# Altium project St_Olavs_Alarm.PrjPcb
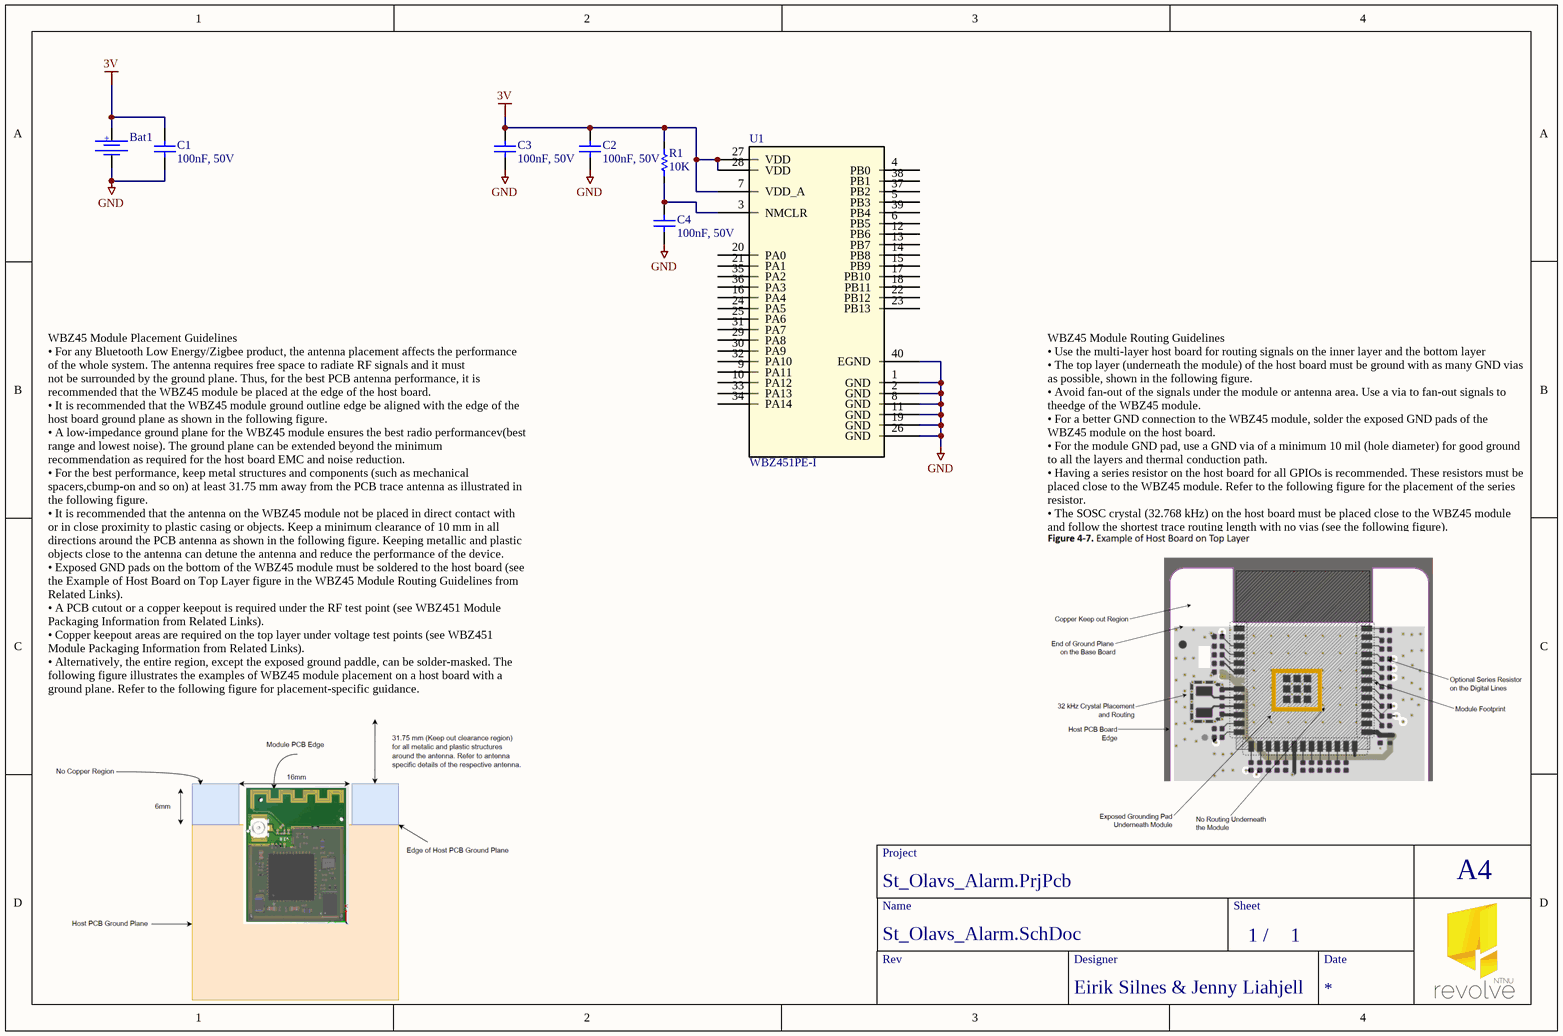
[diagram p0: St_Olavs_Alarm.SchDoc]
ProjectEngineer: Eirik Silnes & Jenny Liahjell
1 sheet, 7 parts. Net scope: strictly hierarchical (ports join the sheet entries above them; power ports are local).
Board file: St_Olavs_Alarm.PcbDoc

## Sheet St_Olavs_Alarm.SchDoc
size 292 x 193 mm; SheetNumber: 1; SheetTotal: 1

### Parts
Bat1  Bat Holder L-KLS5-CR2032-23-B1  [L-KLS5-CR2032-23-B1]  (value not drawn)
C1  100nF, 50V  [0603 Capacitor]
C2  100nF, 50V  [0603 Capacitor]
C3  100nF, 50V  [0603 Capacitor]
C4  100nF, 50V  [0603 Capacitor]
R1  10K  [0603 Resistor]
U1  WBZ451PE-I  [WBZ451_MCH]

### Nets
3V: Bat1.1 C1.2 C2.2 C3.2 R1.1 U1.7(VDD_A) U1.27(VDD) U1.28(VDD)
GND: Bat1.2 C1.1 C2.1 C3.1 C4.1 U1.1(GND) U1.2(GND) U1.8(GND) U1.11(GND) U1.19(GND) U1.26(GND) U1.40(EGND)
NetC4_2: C4.2 R1.2 U1.3(NMCLR)

Not connected (* = marked no-connect by the designer): U1 4(PB0) 5(PB3) 6(PB5) 9(PA11) 10(PA12) 12(PB6) 13(PB7) 14(PB8) 15(PB9) 16(PA4) 17(PB10) 18(PB11) 20(PA0) 21(PA1) 22(PB12) 23(PB13) 24(PA5) 25(PA6) 29(PA8) 30(PA9) 31(PA7) 32(PA10) 33(PA13) 34(PA14) 35(PA2) 36(PA3) 37(PB2) 38(PB1) 39(PB4)

### Notes on the sheet
- WBZ45 Module Routing Guidelines
  • Use the multi-layer host board for routing signals on the inner layer and the bottom layer
  • The top layer (underneath the module) of the host board must be ground with as many GND vias as possible, shown in the following figure.
  • Avoid fan-out of the signals under the module or antenna area. Use a via to fan-out signals to theedge of the WBZ45 module.
  • For a better GND connection to the WBZ45 module, solder the exposed GND pads of the WBZ45 module on the host board.
  • For the module GND pad, use a GND via of a minimum 10 mil (hole diameter) for good ground to all the layers and thermal conduction path.
  • Having a series resistor on the host board for all GPIOs is recommended. These resistors must be placed close to the WBZ45 module. Refer to the following figure for the placement of the series resistor.
  • The SOSC crystal (32.768 kHz) on the host board must be placed close to the WBZ45 module and follow the shortest trace routing length with no vias (see the following figure).
- WBZ45 Module Placement Guidelines
  • For any Bluetooth Low Energy/Zigbee product, the antenna placement affects the performance of the whole system. The antenna requires free space to radiate RF signals and it must
  not be surrounded by the ground plane. Thus, for the best PCB antenna performance, it is recommended that the WBZ45 module be placed at the edge of the host board.
  • It is recommended that the WBZ45 module ground outline edge be aligned with the edge of the
  host board ground plane as shown in the following figure.
  • A low-impedance ground plane for the WBZ45 module ensures the best radio performancev(best range and lowest noise). The ground plane can be extended beyond the minimum
  recommendation as required for the host board EMC and noise reduction.
  • For the best performance, keep metal structures and components (such as mechanical spacers,cbump-on and so on) at least 31.75 mm away from the PCB trace antenna as illustrated in the following figure.
  • It is recommended that the antenna on the WBZ45 module not be placed in direct contact with or in close proximity to plastic casing or objects. Keep a minimum clearance of 10 mm in all directions around the PCB antenna as shown in the following figure. Keeping metallic and plastic objects close to the antenna can detune the antenna and reduce the performance of the device.
  • Exposed GND pads on the bottom of the WBZ45 module must be soldered to the host board (see the Example of Host Board on Top Layer figure in the WBZ45 Module Routing Guidelines from Related Links).
  • A PCB cutout or a copper keepout is required under the RF test point (see WBZ451 Module Packaging Information from Related Links).
  • Copper keepout areas are required on the top layer under voltage test points (see WBZ451 Module Packaging Information from Related Links).
  • Alternatively, the entire region, except the exposed ground paddle, can be solder-masked. The following figure illustrates the examples of WBZ45 module placement on a host board with a ground plane. Refer to the following figure for placement-specific guidance.
- Project
- Name
- Sheet
- A4
- Rev
- Designer
- /
- Date
- (in symbol CMP-023-000003.0.1) +

### Library data of the parts
Bat1 = CMP-023-000003.0.1: Bat Holder CR2032 SMD; Manufacturer: KLS Electronic; Artikkelnr Noca: N.A.; Pad Count: 2; ComponentLink2URL: N.A.; Component Class: Connectors; ComponentLink1Description: Datasheet; LatestRevisionDate: 2019-08-29; Source: pca10056.SCHLIB; Author: rsk; Part Number: Bat Holder L-KLS5-CR2032-23-B1; Component Type: Standard; Value: Bat Holder CR2032; Footprint Doc: CR2032_HOLDER; Published: 2019-08-28; PartId: 100500651; Design Item ID: Bat Holder L-KLS5-CR2032-23-B1; ComponentLink2Description: Supplier link; Note: Bat Holder CR2032; Part number IPS: N.A.; ComponentLink1URL: http://www.klsele.com/admin/product_upload/20151124103736KLS5-CR2032-23-B.pdf; HelpURL: http://www.klsele.com/products/connectors/Coin-Cell-Holders-Series/4685.html; Part number Norautron: N.A.; Pin Count: 2; Manufacturer Part Number: L-KLS5-CR2032-23-B1
C1-C4 = CMP-001-I84.0.9: 100nF, 50V, 10%, X7R, 0603
R1 = CMP-001-J12.0.3: 10K, 1%, 1/10W, 0603
U1 = WBZ451PE-I: No Description Available; Mfr_Name: Microchip; Copyright: Copyright (C) 2024 Ultra Librarian. All rights reserved.; Manufacturer_Part_Number: WBZ451PE-I; RefDes: RefDes; Type: DEV